# Altium schematic sheet GNSS.SchDoc
size C; SheetNumber: 4; SheetTotal: 4
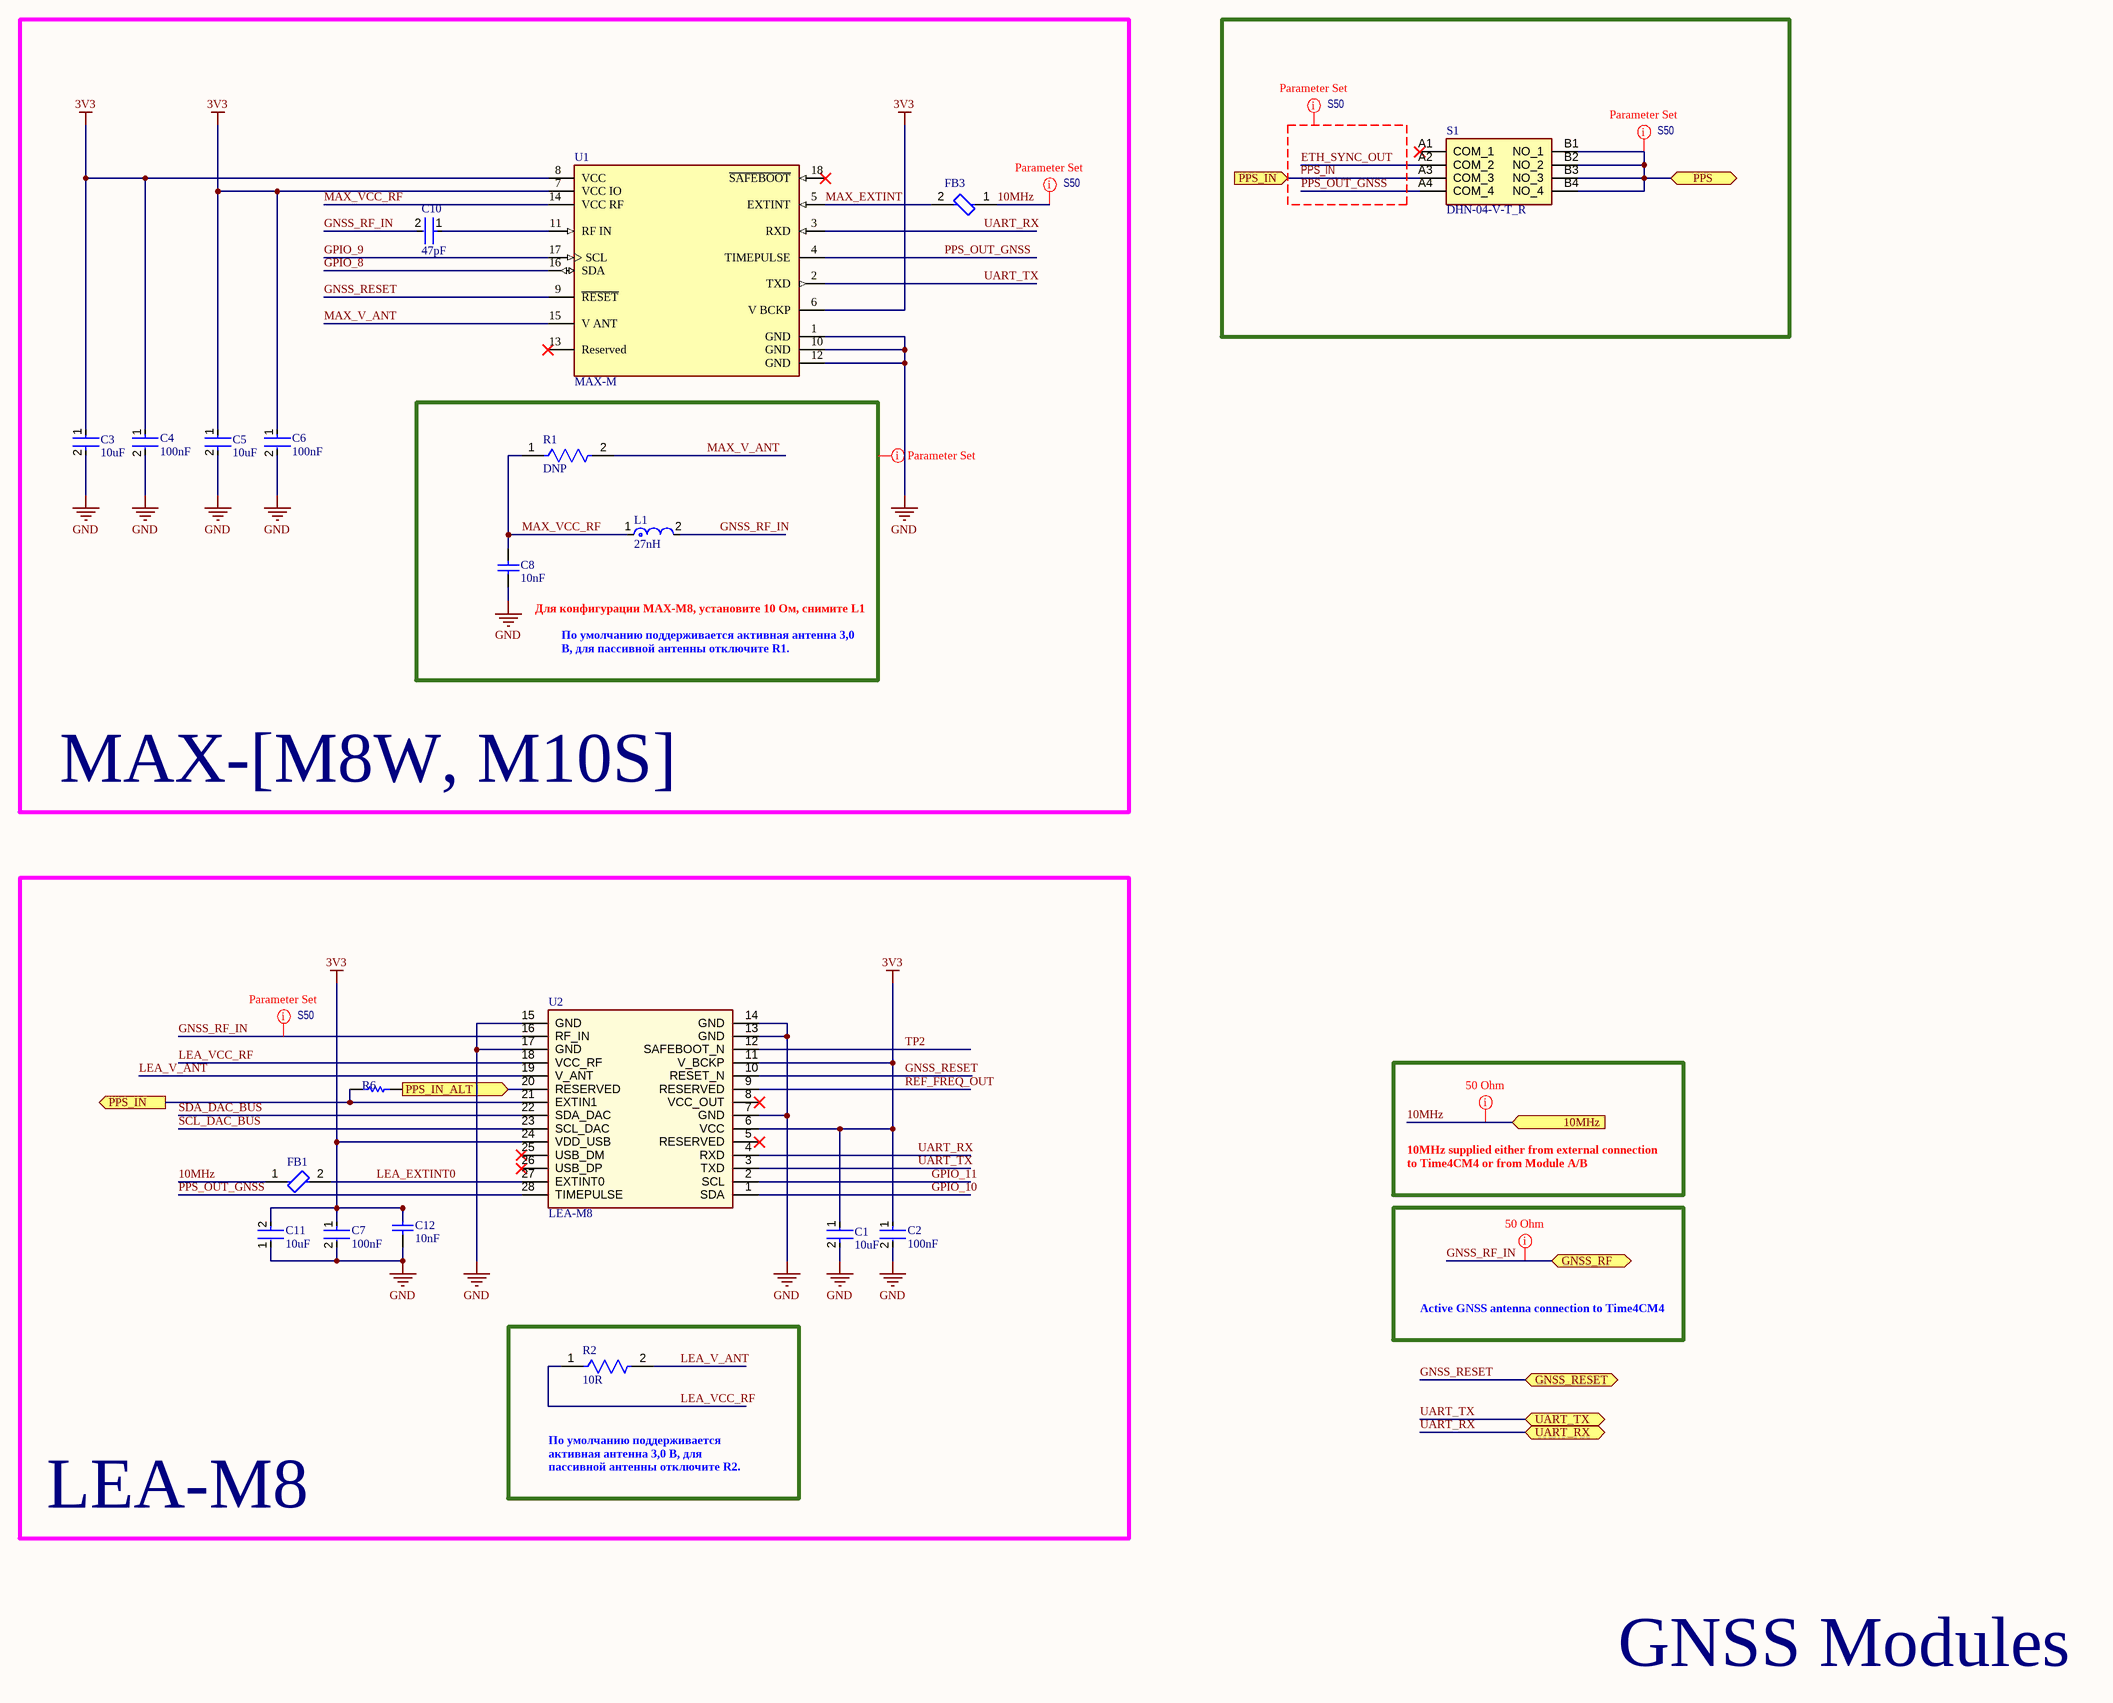
[diagram p0: GNSS.SchDoc]

## Parts
C1  10uF  [FP-C1608-080-0_1-IPC_A]
C2  100nF  [FP-C0603C-CF-MFG]
C3  10uF  [FP-C1608-080-0_1-IPC_A]
C4  100nF  [FP-C0603C-CF-MFG]
C5  10uF  [FP-C1608-080-0_1-IPC_A]
C6  100nF  [FP-C0603C-CF-MFG]
C7  100nF  [FP-C0603C-CF-MFG]
C8  10nF  [CAPC1608X90X35LL15T15]
C10  47pF  [FP-C0402-BB-MFG]
C11  10uF  [FP-C1608-080-0_1-MFG]
C12  10nF  [CAPC1608X90X35LL15T15]
FB1  BLM18HG102SH1D  [FP-BLM18-0_15-t0_8-IPC_C]  (value not drawn)
FB3  BLM18HG102SH1D  [FP-BLM18-0_15-t0_8-IPC_C]  (value not drawn)
L1  27nH  [FP-LQG15HH_02-IPC_C]
R1  DNP  [FP-ERJ3EK-MFG]
R2  10R  [FP-ERJ3EK-MFG]
R6  0R  [RESC1608X55X25ML10T15]  (value not drawn)
S1  DHN-04-V-T_R  [DHN04VTR]
U1  MAX-M  [FP-MAX-M8W-0-MFG]
U2  LEA-M8  [LEA]

## Blocks framed on the sheet
MAX-[M8W, M10S]: C3-C6 C8 C10 FB3 L1 R1 U1
LEA-M8: C1 C2 C7 C11 C12 FB1 R2 R6 U2

## Ports
10MHz (in), GNSS_RESET (bidir), GNSS_RF (bidir), PPS (bidir), PPS_IN (in), PPS_IN (out), PPS_IN_ALT (in), UART_RX (bidir), UART_TX (bidir)

## Nets
3V3: C1.1 C2.1 C3.1 C4.1 C5.1 C6.1 C7.1 C11.2 C12.2 U1.6(V_BCKP) U1.7(VCC_IO) U1.8(VCC) U2.6(VCC) U2.11(V_BCKP) U2.24(VDD_USB)
GND: C1.2 C2.2 C3.2 C4.2 C5.2 C6.2 C7.2 C8.1 C11.1 C12.1 U1.1(GND) U1.10(GND) U1.12(GND) U2.7(GND) U2.13(GND) U2.14(GND) U2.15(GND) U2.17(GND)
10MHz: FB1.1 FB3.1 ; port 10MHz
ETH_SYNC_OUT: S1.A2(COM_2)
GNSS_RESET: U1.9(~{RESET}) U2.10(RESET_N) ; port GNSS_RESET
GNSS_RF_IN: C10.2 L1.2 U2.16(RF_IN) ; port GNSS_RF
GPIO_8: U1.16(SDA)
GPIO_9: U1.17(SCL)
GPIO_10: U2.1(SDA)
GPIO_11: U2.2(SCL)
LEA_EXTINT0: FB1.2 U2.27(EXTINT0)
LEA_V_ANT: R2.2 U2.19(V_ANT)
LEA_VCC_RF: R2.1 U2.18(VCC_RF)
MAX_EXTINT: FB3.2 U1.5(EXTINT)
MAX_V_ANT: R1.2 U1.15(V_ANT)
MAX_VCC_RF: C8.2 L1.1 R1.1 U1.14(VCC_RF)
PPS: S1.B1(NO_1) S1.B2(NO_2) S1.B3(NO_3) S1.B4(NO_4) ; port PPS
PPS_IN: R6.1 S1.A3(COM_3) U2.21(EXTIN1) ; port PPS_IN
PPS_IN_ALT: R6.2 U2.20(RESERVED) ; port PPS_IN_ALT
PPS_OUT_GNSS: S1.A4(COM_4) U1.4(TIMEPULSE) U2.28(TIMEPULSE)
REF_FREQ_OUT: U2.9(RESERVED)
SCL_DAC_BUS: U2.23(SCL_DAC)
SDA_DAC_BUS: U2.22(SDA_DAC)
TP2: U2.12(SAFEBOOT_N)
UART_RX: U1.3(RXD) U2.4(RXD) ; port UART_RX
UART_TX: U1.2(TXD) U2.3(TXD) ; port UART_TX
NetC10_1: C10.1 U1.11(RF_IN)

Not connected (* = marked no-connect by the designer): S1 A1(COM_1)*; U1 13(Reserved)* 18(~{SAFEBOOT})*; U2 5(RESERVED)* 8(VCC_OUT)* 25(USB_DM)* 26(USB_DP)*

## Layout directives
net class RF: 10MHz, GNSS_RF_IN
net class S50: 10MHz, ETH_SYNC_OUT, GNSS_RF_IN, PPS, PPS_IN, PPS_OUT_GNSS

## Notes on the sheet
- (near C8) Для конфигурации MAX-M8, установите 10 Ом, снимите L1
- По умолчанию поддерживается активная антенна 3,0 В, для пассивной антенны отключите R1.
- 10MHz supplied either from external connection to Time4CM4 or from Module A/B
- Active GNSS antenna connection to Time4CM4
- По умолчанию поддерживается активная антенна 3,0 В, для пассивной антенны отключите R2.
- GNSS Modules
- DWG. NO.
- REV.
- SHT.
- REVISION
- DESCRIPTION
- DATE
- APPROVED
- THIS DOCUMENT AND THE DATA DISCLOSED HEREIN OR HEREWITH IS THE PROPERTY OF ALTIUM LIMITED AND MAY BE FREELY DISTRIBUTED IN WHOLE. NO RIGHTS ARE RESERVED OR EXPRESS OR IMPLIED WARANTEE GIVEN.
- ENG:
- DSN:
- APPROVALS
- PROJECT
- DOCUMENT REVISION:
- DESIGN ITEM:
- CHK:
- BOM:
- REFERENCE DOCUMENTS
- PROJECT REVISION:
- TITLE
- FAB DWG:
- PCB DWG:
- ASSY DWG:
- SCALE:
- SIZE
- C
- CAGE CODE
- FILE NAME
- DWG NO.
- SHEET
- OF
- REV

## Library data of the parts
C1 C3 C5 C11 = CMP-2000-04979-3: Multilayer Ceramic Capacitors 10μF ±10% 10V X5R SMD 0603; Dielectric Material: Ceramic; Construction: Flat; Height: 0.8mm; Thickness: 0.035inch; Case Code (Metric): 1608; Radiation Hardening: No; Number of Pins: 2; Voltage Rating (DC): 10V; Depth: 0.8mm; Voltage: 10V; RoHS Compliant: Yes; Voltage Rating: 10V; Package Quantity: 1; Resistor Type: Ceramic; Termination: SMD/SMT; Lead Free: Lead Free; REACH SVHC: No SVHC; Tolerance: 10%; Mount: Surface Mount; Series: C; Packaging: Tape and Reel; Width: 0.8mm; Dielectric: X5R; Weight: 7.1E-05oz; Length: 1.6mm; Max Operating Temperature: 85°C; Case Code (Imperial): 0603; Case/Package: 0603; Min Operating Temperature: -55°C; Capacitance: 10uF
C2 C4 C6 C7 = CMP-2006-03068-2: CAP CER 0.1UF 50V 20% X7R 0603; Manufacturer Part Number: C0603C104M5RACTU; Manufacturer: KEMET; Material: Ceramic; Tolerance: 0.2; Value: 0.10 μF; Temperature Coefficient: 30ppm/°C; Automotive Grade: Grade 1; Temperature Range High: +125°C; Voltage Rating: 50 V; Device Class L3: Ceramic Capacitors; Height: 0.87mm; Category: Cap; RoHS: TRUE; Digikey Description: CAP CER 0.1UF 50V 20% X7R 0603; ComponentLink2URL: https://api.kemet.com/component-edge/download/datasheet/C0603C100J5GACAUTO.pdf; Lead Free: Yes; Temperature Range Low: -55°C; Device Class L1: Passive Components; ComponentLink2Description: Datasheet; Temperature Characteristic: X7R; Automotive: Yes; Temperature: -55°C to +125°C; Octopart: https://octopart.com/c0603c104m5ractu-kemet-11855687; Device Class L2: Capacitors; Package: C0603C-CF; Mouser Description: Multilayer Ceramic Capacitors MLCC - SMD/SMT 50volts 0.1uF X7R 20%; Capacitance: 0.10 μF
C8 = CMP-2006-02059-1: Multilayer Ceramic Capacitor, 0.01 uF, 16 V, ± 10%, X7R, 0603 [1608 Metric]; Manufacturer: AVX Interconnect / Elco; Part Number: 0603YC103KAT2A; Voltage Rating (DC): 16V; Dissipation Factor: 3.5%; Supplier 1: Arrow Electronics; Supplier Part Number 1: 0603YC103KAT2A; Manufacturer Part Number: 0603YC103KAT2A; RoHS: Yes; Category: Ceramic Capacitors; Stock 1: 910956; Pricing 1: 4000=0.02200, 8000=0.02060, 12000=0.01980, 20000=0.01970, 24000=0.01700, 100000=0.01460 (USD); Mount: Surface Mount; Case/Package: 0603; Case Code (Metric): 1608; Case Code (Imperial): 0603; Min Operating Temperature: -55°C; Max Operating Temperature: 125°C; Capacitance: 10nF; Tolerance: 10%; Dielectric: X7R; Packaging: Tape and Reel; Voltage Rating: 16V; Package Quantity: 1; Termination: SMD/SMT; Voltage: 16V; Series: -; Construction: Flat; Length: 1.6mm; Width: 0.032inch; Depth: 0.81mm; Thickness: 0.035inch; Radiation Hardening: No; REACH SVHC: No SVHC; Lead Free: Lead Free; RoHS Compliant: Yes; ComponentLink1URL: https://datasheet.ciiva.com/150/cx7r-150743.pdf?src-supplier=Digi-Key; ComponentLink1Description: https://datasheet.ciiva.com/150/cx7r-150743.pdf?src-supplier=Digi-Key; ComponentLink2URL: https://datasheet.ciiva.com/150/cx7r-150744.pdf?src-supplier=Digi-Key; ComponentLink2Description: https://datasheet.ciiva.com/150/cx7r-150744.pdf?src-supplier=Digi-Key; ComponentLink3URL: https://datasheet.ciiva.com/150/cx7r-150745.pdf?src-supplier=Digi-Key; ComponentLink3Description: https://datasheet.ciiva.com/150/cx7r-150745.pdf?src-supplier=Digi-Key; ComponentLink4URL: https://datasheet.ciiva.com/5412/cx7r-218113-5412060.pdf?src-supplier=Mouser; ComponentLink4Description: https://datasheet.ciiva.com/5412/cx7r-218113-5412060.pdf?src-supplier=Mouser; ComponentLink5URL: https://datasheet.ciiva.com/16375/cx7r-16375919.pdf?src-supplier=Future+Electronics; ComponentLink5Description: https://datasheet.ciiva.com/16375/cx7r-16375919.pdf?src-supplier=Future+Electronics; ComponentLink6URL: https://datasheet.ciiva.com/7855/1679506-7855103.pdf?src-supplier=Element14; ComponentLink6Description: https://datasheet.ciiva.com/7855/1679506-7855103.pdf?src-supplier=Element14; ComponentLink7URL: https://datasheet.ciiva.com/22683/1679506-22683367.pdf?src-supplier=Element14; ComponentLink7Description: https://datasheet.ciiva.com/22683/1679506-22683367.pdf?src-supplier=Element14; ComponentLink8URL: https://datasheet.ciiva.com/22699/1679506-22699610.pdf?src-supplier=Element14; ComponentLink8Description: https://datasheet.ciiva.com/22699/1679506-22699610.pdf?src-supplier=Element14
C10 = CMP-2008-03364-2: CAP CER 47PF 25V 5% NP0 0402; Manufacturer Part Number: C0402C470J3GACTU; Manufacturer: Kemet; Material: Ceramic; Temperature Coefficient: 15%; Temperature Characteristic: C0G; Tolerance: 0.05; RoHS: TRUE; Category: Cap; Device Class L1: Passive Components; Device Class L3: Ceramic Capacitors; Voltage Rating: 25 V; Automotive: No; Octopart: https://octopart.com/c0402c470j3gactu-kemet-9139794; Value: 47 pF; Package: C0402-BB; Temperature: -55°C to +125°C; Mouser Description: Multilayer Ceramic Capacitors MLCC - SMD/SMT 25volts 47pF C0G 5%; Temperature Range Low: -55°C; Temperature Range High: +125°C; Lead Free: Yes; Capacitance: 47 pF; Digikey Description: CAP CER 47PF 25V 5% NP0 0402; Device Class L2: Capacitors; ComponentLink2URL: https://content.kemet.com/datasheets/KEM_C1002_X7R_SMD.pdf; Height: 0.55mm; ComponentLink2Description: Datasheet; Ipc Land Pattern Name: CAPC10050X50
C12 = CMP-2006-02059-1: Manufacturer: AVX Interconnect / Elco; Part Number: 0603YC103KAT2A
FB1 FB3 = CMP-06046-001255-1: Chip Ferrite Bead, 0603, 1000Ω @ 100MHz, 1.6Ω, 25%, 100mA; Number of Circuits: 1; DC Resistance (DCR): 1.6R; Shielding: Unshielded; Impedance: 1kR; Max Current Rating: 100mA; Case Code (Metric): 1608; Number of Lines: 1; Ratings: AEC-Q200; Test Frequency: 100MHz; Case Code (Imperial): 0603; Min Operating Temperature: -55°C; Height: 0.037inch; Contact Plating: Tin; Package Quantity: 4000; Width: 0.8mm; Packaging: Tape and Reel; Mount: Surface Mount; Case/Package: 0603; Max Operating Temperature: 125°C; Length: 1.6mm; Max DC Current: 100mA; Tolerance: 25%; Termination: SMD/SMT
L1 = CMP-2000-06578-2: Multilayer type RF Inductor 27nH ±5% 0.46Ω 350mA 0402; DC Current: 300mA; Core Material: Air; Self Resonant Frequency: 1.7GHz; Q Factor: 8; DC Resistance (DCR): 460mR; Shielding: Unshielded; Test Frequency: 100MHz; Inductance: 27nH; Width: 0.02inch; Length: 1mm; Height - Seated (Max): 0.022inch; Military Standard: Not; Case Code (Imperial): 0402; Tolerance: 5%; Depth: 0.55mm; Current Rating: 300mA; Inductance Tolerance: 5%; Lead Free: Lead Free; Height: 0.5mm; Max DC Current: 300mA; REACH SVHC: No SVHC; Package Quantity: 10000; Mount: Surface Mount; Termination: SMD/SMT; Case Code (Metric): 1005; Case/Package: 0402; Max Operating Temperature: 125°C; Packaging: Tape and Reel; Min Operating Temperature: -55°C
R1 R2 = CMP-2000-00195-2: RES SMD 10 OHM 1% 1/10W 0603; Manufacturer Part Number: ERJ-3EKF10R0V; Manufacturer: Panasonic; Resistance: 10Ω; Voltage Rating: 75V; Value: 10Ω; Power: 100mW; Power Rating: 0.1W; Temperature Coefficient: 100ppm/°C; Automotive Grade: Grade 0; Lead Free: Yes; Device Class L1: Passive Components; Digikey Description: RES SMD 10 OHM 1% 1/10W 0603; Octopart: https://octopart.com/erj-3ekf10r0v-panasonic-55403649; Automotive: Yes; ComponentLink2URL: https://b2b-api.panasonic.eu/file_stream/pids/fileversion/1263; Height: 0.55mm; Temperature Range High: +155°C; Footprint Url: https://industrial.panasonic.com/cdbs/www-data/pdf/RDA0000/DMA0000COL17.pdf; Temperature: -55°C to +155°C; Tolerance: 1%; ComponentLink2Description: Datasheet; Package: ERJ3EK; Device Class L2: Resistors; Category: Res; Ipc Land Pattern Name: RESC16080X45; RoHS: TRUE; Composition: Thick Film; Device Class L3: Chip SMD Resistors; Temperature Range Low: -55°C; Series: ERJ
R6 = CMP-2100-03667-1: Chip Resistor, 0 Ohm, +/- 5%, 0.1 W, -55 to 155 degC, 0603 (1608 Metric), RoHS, Tape and Reel; Manufacturer: Yageo; Temperature Coefficient: 200ppm/degreesC; Voltage Rating: 50V; Power Rating: 100mW; Resistance: 0mOhm; Width: 0.8mm; Max Operating Temperature: 155degC; Tolerance: 5%; Package Reference: 0603; Height: 0.45mm; Depth: 0.8mm; Package Description: 2-Pin Surface Mount Device, Body 1.6 x 0.8 mm; Termination: SMD/SMT; Package Quantity: 5000; Case/Package: 0603; Case Code (Imperial): 0603; Radiation Hardening: No; Number of Pins: 2; Length: 1.6mm; Lead Free: LeadFree; Voltage Rating (DC): 50V; Military Standard: Not; Datasheet URL: http://www.yageo.com/NewPortal/yageodocoutput?fileName=/pdf/R-Chip/PYu-RC_Group_51_RoHS_L_5.pdf; Manufacturer URL: http://www.yageo.com/; Packaging: TapeandReel; Case Code (Metric): 1608; Min Operating Temperature: -55degC; Composition: ThickFilm; RoHSCompliant: true; Contact Plating: Tin; Datasheet Version: Rev. 5, 10/2016; REACH SVHC: NoSVHC
S1 = DHN-04-V-T_R: Switch; Manufacturer_Name: Diptronics; Manufacturer_Part_Number: DHN-04-V-T/R; Datasheet Link: https://datasheet.lcsc.com/lcsc/1809172046_Diptronics-DHN-04-V-T-R_C224996.pdf; Height: 1.65mm; Mouser Part Number: 113-DHN04VTR; Mouser Price/Stock: https://www.mouser.co.uk/ProductDetail/Diptronics/DHN-04-V-T-R?qs=MLItCLRbWszy0w3dgyiNuw%3D%3D
U1 = CMP-207130-000023-1: RF RCVR GNSS/GPS 1.575GHZ 18LCC; Current - Receiving: 23mA; Interface: I2C; Sensitivity: -167dBm; Frequency: 1.575GHz; Min Operating Temperature: -40°C; Packaging: Tape and Reel; RoHS Compliant: Yes; Max Operating Temperature: 85°C; Case/Package: SMD/SMT
U2 = LEA: u-blox LEA GNSS module; Part Description: u-blox LEA-M8 GNSS module; Manufacturer: u-blox; Value: LEA-M8